# Altium project PIC16F_PCB.PrjPcb
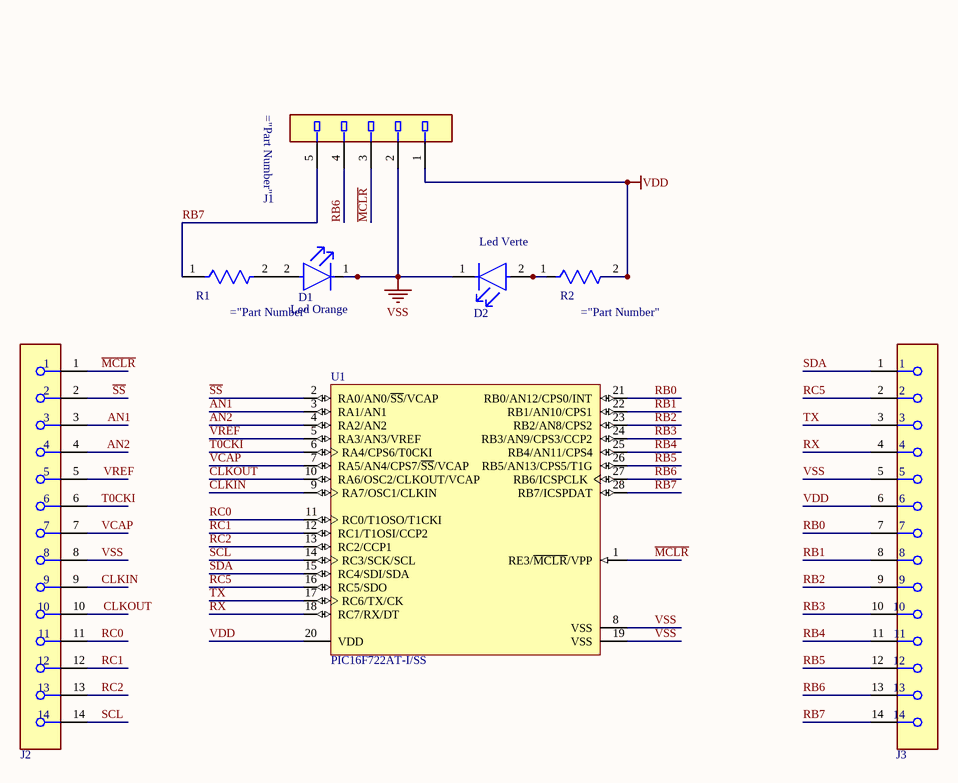
[diagram p0: PIC16F_Schematic.SchDoc]
1 sheet, 8 parts. Net scope: global (net labels, ports and power ports of the same name join across sheets).
Board file: PIC16F_PCB.PcbDoc

## Sheet PIC16F_Schematic.SchDoc
size A4; SheetNumber: 1; SheetTotal: 1

### Parts
D1  LO_Q976-PS-25-0-20-R18  [Osram_Opto_LO_Q976_MFG]  (value not drawn)
D2  LTST-C190GKT  [Lite-On_0_MFG]  (value not drawn)
J1  61300511121  [Wurth_61300511121_0]  (value not drawn)
J2  PPTC141LFBN-RC  [Sullins_0_MFG]  (value not drawn)
J3  PPTC141LFBN-RC  [Sullins_0_MFG]  (value not drawn)
R1  RMCF0603FT220R  [Yageo_RC0805_IPC_B]  (value not drawn)
R2  RMCF0603FT220R  [Yageo_RC0805_MFG]  (value not drawn)
U1  PIC16F722AT-I/SS  [MCHP-SSOP-SS28_M]

### Nets
VDD: J1.1 J3.6 R2.2 U1.20(VDD)
VSS: D1.1(C) D2.1(C) J1.2 J2.8 J3.5 U1.8(VSS) U1.19(VSS)
~{MCLR}: J1.3 J2.1 U1.1(RE3/~{MCLR}/VPP)
~{SS}: J2.2 U1.2(RA0/AN0/~{SS}/VCAP)
AN1: J2.3 U1.3(RA1/AN1)
AN2: J2.4 U1.4(RA2/AN2)
CLKIN: J2.9 U1.9(RA7/OSC1/CLKIN)
CLKOUT: J2.10 U1.10(RA6/OSC2/CLKOUT/VCAP)
RB0: J3.7 U1.21(RB0/AN12/CPS0/INT)
RB1: J3.8 U1.22(RB1/AN10/CPS1)
RB2: J3.9 U1.23(RB2/AN8/CPS2)
RB3: J3.10 U1.24(RB3/AN9/CPS3/CCP2)
RB4: J3.11 U1.25(RB4/AN11/CPS4)
RB5: J3.12 U1.26(RB5/AN13/CPS5/T1G)
RB6: J1.4 J3.13 U1.27(RB6/ICSPCLK)
RB7: J1.5 J3.14 R1.1 U1.28(RB7/ICSPDAT)
RC0: J2.11 U1.11(RC0/T1OSO/T1CKI)
RC1: J2.12 U1.12(RC1/T1OSI/CCP2)
RC2: J2.13 U1.13(RC2/CCP1)
RC5: J3.2 U1.16(RC5/SDO)
RX: J3.4 U1.18(RC7/RX/DT)
SCL: J2.14 U1.14(RC3/SCK/SCL)
SDA: J3.1 U1.15(RC4/SDI/SDA)
T0CKI: J2.6 U1.6(RA4/CPS6/T0CKI)
TX: J3.3 U1.17(RC6/TX/CK)
VCAP: J2.7 U1.7(RA5/AN4/CPS7/~{SS}/VCAP)
VREF: J2.5 U1.5(RA3/AN3/VREF)
NetD1_2: D1.2(A) R1.2
NetD2_2: D2.2(A) R2.1

### Notes on the sheet
- Led Verte
- (near D1) Led Orange

### Library data of the parts
U1 = PIC16F722AT-I/SS: Flash Microcontroller with nanoWatt XLP Technology, 20 MHz, 24 I/O, -40 to 85 degC, 28-pin SSOP (SS28), Tape and Reel; Manufacturer: Microchip; Internal Oscillator: 16 MHz, 500 kHz; Program Memory KWords: 2; I/O Pins: 24; RAM: 128; Max. CPU Speed MHz: 20; Packing: T/R; Operation Voltage Range: 1.8V - 5.5V; Digital Communication: 1 -A/E/USART, 1 -SSP(SPI/I2C); Timers: 2 - 8-bit, 1 - 16-bit, 0 - 32-bit; Program Memory KBytes: 3.5; # of A/D Channels: 11; PartNumber: PIC16F722AT-I/SS; ComponentLink1Description: Datasheet; ComponentLink2Description: Package Specification; DatasheetVersion: Rev. B; ComponentLink3URL: Product URL:http://www.microchip.com/datasheet/PIC16F722A; ComponentLink1URL: http://ww1.microchip.com/downloads/en/DeviceDoc/41417B.pdf; ComponentLink2URL: http://www.microchip.com/stellent/groups/techpub_sg/documents/packagingspec/en012702.pdf; PackageReference: SSOP-SS28; ComponentLink3Description: URL Link1; PackageVersion: C04-073B, 12/2012; RoHS: TRUE; Memory Type: Flash; Mounting Technology: Surface Mount; PackageDescription: 28-Lead Plastic Shrink Small Outline, 10.2 x 5.3 mm Body, 0.65 mm Pitch